# EAGLE design CAN_Shield_with_Regulator_v1.0 (EAGLE 8.1.1)
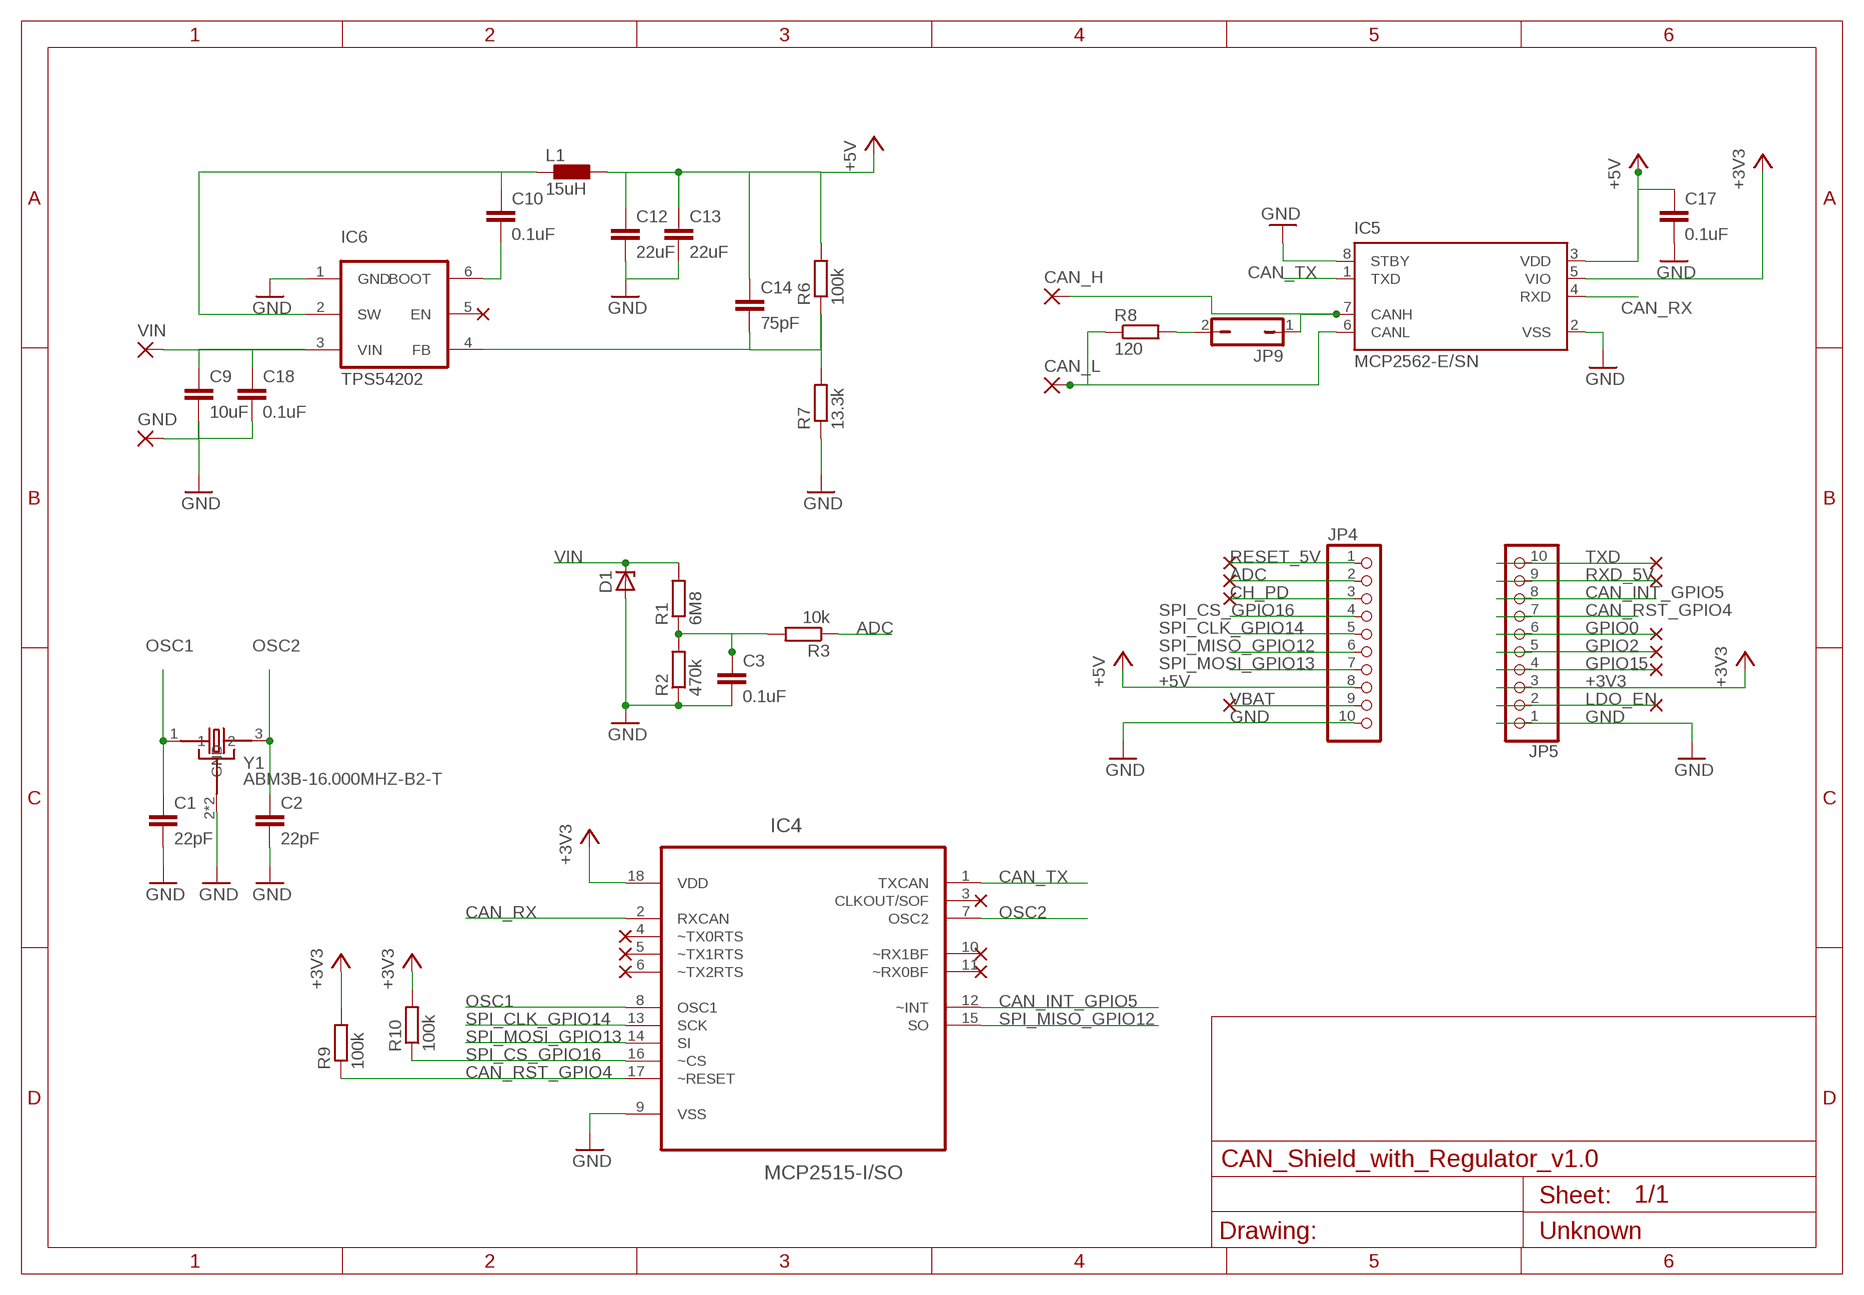
[diagram p0: schematic, sheet 1]

## Parts
C1  22pF  C  [C0805]
C2  22pF  C  [C0805]
C3  0.1uF  CC1206  [C1206]
C9  10uF  CC1206  [C1206]
C10  0.1uF  CC1206  [C1206]
C12  22uF  CC1206  [C1206]
C13  22uF  CC1206  [C1206]
C14  75pF  CC1206  [C1206]
C17  0.1uF  CC1206  [C1206]
C18  0.1uF  CC1206  [C1206]
CAN_H  WIREPADSMD5-2,5  [5-2,5]
CAN_L  WIREPADSMD5-2,5  [5-2,5]
D1  ZENER-DIODE  [SOD3715X135N]
GND  WIREPADSMD5-2,5  [5-2,5]
IC4  MCP2515-I/SO  [SOIC127P1034X264-18N]
IC5  MCP2562-E/SN  [SOIC127P600X175-8N]
IC6  TPS54202  [SOT3-6P]
JP4  HEADER-1X1070MIL  [1X10_ROUND70]
JP5  HEADER-1X1070MIL  [1X10_ROUND70]
JP9  JP1Q  [JP1]
L1  15uH  INDUCTOR  [ER1515AH]
R1  6M8  RR1206  [R1206]
R2  470k  RR1206  [R1206]
R3  10k  RR1206  [R1206]
R6  100k  RR1206  [R1206]
R7  13.3k  RR1206  [R1206]
R8  120  RR1206  [R1206]
R9  100k  RR1206  [R1206]
R10  100k  RR1206  [R1206]
VIN  WIREPADSMD5-2,5  [5-2,5]
Y1  ABM3B-16.000MHZ-B2-T  [OSCSC500X320X110-4N]

## Nets
+3V3 [power]: IC4.18(VDD) IC5.5(VIO) JP5.3 R9.2 R10.2
+5V [power]: C12.1 C13.1 C14.1 C17.1 IC5.3(VDD) JP4.8 L1.P$1 R6.2
ADC: JP4.2 R3.1
CAN_H: CAN_H.1(P) IC5.7(CANH) JP9.1
CAN_INT_GPIO5: IC4.12(~INT) JP5.8
CAN_L: CAN_L.1(P) IC5.6(CANL) R8.1
CAN_RST_GPIO4: IC4.17(~RESET) JP5.7 R9.1
CAN_RX: IC4.2(RXCAN) IC5.4(RXD)
CAN_TX: IC4.1(TXCAN) IC5.1(TXD)
CH_PD: JP4.3
GND [power]: C1.2 C2.2 C3.2 C9.2 C12.2 C13.2 C17.2 C18.2 D1.A GND.1(P) IC4.9(VSS) IC5.2(VSS) IC5.8(STBY) IC6.1(GND) JP4.10 JP5.1 R2.1 R7.1 Y1.2(GND) Y1.4(GND)
GPIO0: JP5.6
GPIO2: JP5.5
GPIO15: JP5.4
LDO_EN: JP5.2
N$1: C3.1 R1.1 R2.2 R3.2
N$3 [power]: C10.2 IC6.6(BOOT)
N$5 [power]: C10.1 IC6.2(SW) L1.P$2
N$6 [power]: C14.2 IC6.4(FB) R6.1 R7.2
N$8: JP9.2 R8.2
OSC1: C1.1 IC4.8(OSC1) Y1.1
OSC2: C2.1 IC4.7(OSC2) Y1.3
RESET_5V: JP4.1
RXD_5V: JP5.9
SPI_CLK_GPIO14: IC4.13(SCK) JP4.5
SPI_CS_GPIO16: IC4.16(~CS) JP4.4 R10.1
SPI_MISO_GPIO12: IC4.15(SO) JP4.6
SPI_MOSI_GPIO13: IC4.14(SI) JP4.7
TXD: JP5.10
VBAT: JP4.9
VIN [power]: C9.1 C18.1 D1.C IC6.3(VIN) R1.2 VIN.1(P)
Unconnected: IC4.3(CLKOUT/SOF) IC4.4(~TX0RTS) IC4.5(~TX1RTS) IC4.6(~TX2RTS) IC4.10(~RX1BF) IC4.11(~RX0BF) IC6.5(EN)

## Library data of the parts
C1-C3 C9 C10 C12-C14 C17 C18 = eagle-ltspice:C: CAPACITOR, European symbol; SPICEMODEL: NONE; SPICEPREFIX: C
CAN_H CAN_L GND VIN = wirepad:WIREPAD: Wire PAD connect wire on PCB
D1 = extras:ZENER-DIODE: Z-Diode
IC4 = MCP2515-I_SO:MCP2515-I/SO: CAN Controller; AVAILABILITY: Good; DESCRIPTION: MCP2515 Series 5.5 V 1 Mb/s Stand Alone SPI Interface CAN Controller- SOIC-18; MF: Microchip; MP: MCP2515-I/SO; PACKAGE: SOIC-18 Microchip; PRICE: 1.67 USD
IC5 = MCP2562-E_SN:MCP2562-E/SN: MCP2562 Series 5 V Surface Mount High-Speed CAN Transceiver - SOIC-8; AVAILABILITY: Good; DESCRIPTION: MCP2562 Series 5 V Surface Mount High-Speed CAN Transceiver - SOIC-8; MF: Microchip; MP: MCP2562-E/SN; PACKAGE: SOIC-8 Microchip; PRICE: 0.85 USD
IC6 = TPS54202:TPS54202; AVAILABILITY: Good; DESCRIPTION: 4.5V to 28V Input, 2A Output, EMI Friendly Synchronous Step-Down Converter 6-SOT -40 to 125; MF: Texas Instruments; MP: TPS54202DDCR; PACKAGE: TSOT-23 Texas Instruments; PRICE: 1.16 USD
JP4 JP5 = microbuilder:HEADER-1X10: PIN HEADER
JP9 = jumper:JP1Q: JUMPER
L1 = extras:INDUCTOR
R1-R3 R6-R10 = eagle-ltspice:R: RESISTOR, European symbol; SPICEMODEL: NONE; SPICEPREFIX: R
Y1 = ABM3B-16.000MHZ-B2-T:ABM3B-16.000MHZ-B2-T: Crystal 16MHz 20ppm (Tol) 50ppm (Stability) 18pF FUND 50Ohm 4-Pin CSMD T/R; AVAILABILITY: Good; DESCRIPTION: Crystal 16MHz ??20ppm (Tol) ??50ppm (Stability) 18pF FUND 50Ohm 4-Pin CSMD T/R; MF: Abracon; MP: ABM3B-16.000MHZ-B2-T; PACKAGE: 5.0 x 3.2mm Abracon; PRICE: 0.53 USD

## Net classes
0 default: width 0.254 mm, drill 0.457 mm, clearance 0.254 mm
1 power: width 0.406 mm, drill 0.457 mm, clearance 0.381 mm to class 0, clearance 0.381 mm
2 highpower: width 1.016 mm, drill 0.457 mm, clearance 0.381 mm to class 0, clearance 0.381 mm to class 1, clearance 0.381 mm

## Board
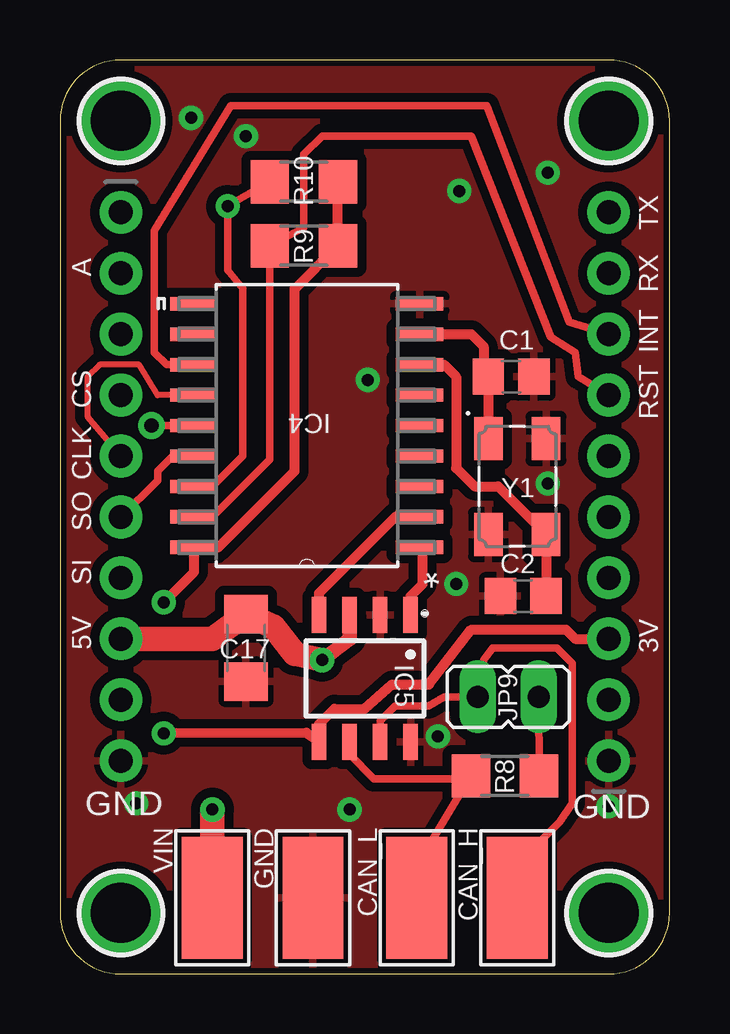
[diagram p1: board, top side]
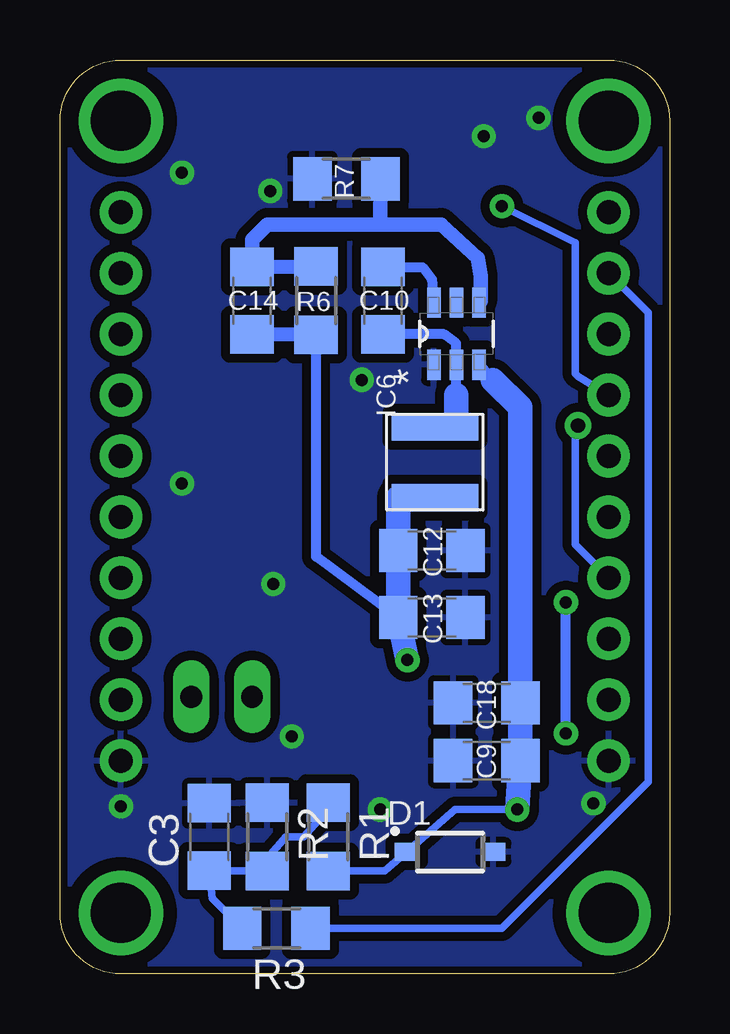
[diagram p2: board, bottom side, seen from below]

Size 25.4 x 38.1 mm. Coordinates in mm from the lower left corner, seen from the top.
Outline: 0,35.56 0,2.54 arc90 2.54,0 22.86,0 arc90 25.4,2.54 25.4,35.56 arc90 22.86,38.1 2.54,38.1 arc90 0,35.56
Copper layers (1*16): Top 0.035mm / dielectric 1.5mm / Bottom 0.035mm
Design rules "Aisler *": minimum track width 0.1mm, minimum drill 0.2mm, track to track 8mil, track to pad 8mil, pad to pad 8mil, via to via 8mil, smd to smd 8mil, copper to edge 10mil, drill to drill 8mil, minimum pad ring 12mil, minimum via ring 10mil, stop-mask expansion 4mil, vias tented up to drill 25mil, thermal gap 10mil

### Footprints (pad centres in the part's own frame; a part is rotated, then mirrored left to right if it is on the bottom)
C0805 = smd 1.3 x 1.5: 1 -0.95,0; 2 0.95,0
C1206 = smd 1.6 x 1.8: 1 -1.4,0; 2 1.4,0
5-2,5 = smd 2.54 x 5.08: 1 0,0
SOD3715X135N = smd 1 x 0.75: A 1.8,0; C -1.8,0
MOUNTINGHOLE_2.5_PLATED = drill 2.5 pad 3.2: P$1 0,0
SOIC127P1034X264-18N = smd 1.981 x 0.559: 1 -4.699,5.08; 2 -4.699,3.81; 3 -4.699,2.54; 4 -4.699,1.27; 5 -4.699,0; 6 -4.699,-1.27; 7 -4.699,-2.54; 8 -4.699,-3.81; 9 -4.699,-5.08; 10 4.699,-5.08; 11 4.699,-3.81; 12 4.699,-2.54; 13 4.699,-1.27; 14 4.699,0; 15 4.699,1.27; 16 4.699,2.54; 17 4.699,3.81; 18 4.699,5.08
SOIC127P600X175-8N = smd 1.5 x 0.6: 1 -2.65,1.905; 2 -2.65,0.635; 3 -2.65,-0.635; 4 -2.65,-1.905; 5 2.65,-1.905; 6 2.65,-0.635; 7 2.65,0.635; 8 2.65,1.905
SOT3-6P = smd 1.27 x 0.559: 1 -1.275,0.93; 2 -1.275,-0.01; 3 -1.275,-0.95; 4 1.315,-0.95; 5 1.315,-0.01; 6 1.315,0.93
1X10_ROUND70 = drill 1 pad 1.778: 1 -11.43,0; 2 -8.89,0; 3 -6.35,0; 4 -3.81,0; 5 -1.27,0; 6 1.27,0; 7 3.81,0; 8 6.35,0; 9 8.89,0; 10 11.43,0
JP1 = drill 0.914 long: 1 0,-1.27; 2 0,1.27
ER1515AH = smd 1.15 x 3.6: P$1 -1.48,0; P$2 1.48,0
R1206 = smd 1.6 x 1.803: 1 -1.422,0; 2 1.422,0
OSCSC500X320X110-4N = smd 1.2 x 1.8: 1 -1.2,2; 2 -1.2,-2; 3 1.2,-2; 4 1.2,2

### Placement (x,y rotation side)
C1  18.8,24.89 0 top
C2  19.3,15.75 180 top
C3  19.18,5.71 90 bottom
C9  7.62,8.89 180 bottom
C10  11.94,28.07 90 bottom
C12  9.91,17.65 0 bottom
C13  9.91,14.86 0 bottom
C14  17.4,28.07 90 bottom
C17  7.75,13.59 270 top
C18  7.62,11.3 180 bottom
CAN_H  19.05,3.17 0 top
CAN_L  14.86,3.17 0 top
D1  9.14,5.08 0 bottom
E$1  [MOUNTINGHOLE_2.5_PLATED]  22.86,2.54 0 top
E$2  [MOUNTINGHOLE_2.5_PLATED]  2.54,2.54 0 top
E$3  [MOUNTINGHOLE_2.5_PLATED]  2.54,35.56 0 top
E$4  [MOUNTINGHOLE_2.5_PLATED]  22.86,35.56 0 top
GND  10.54,3.17 0 top
IC4  10.29,22.86 180 top
IC5  12.7,12.32 270 top
IC6  8.89,26.67 90 bottom
JP4  2.54,20.32 270 top
JP5  22.86,20.32 90 top
JP9  18.67,11.56 270 top
L1  9.78,21.34 90 bottom
R1  14.22,5.71 270 bottom
R2  16.76,5.71 270 bottom
R3  16.38,1.91 180 bottom
R6  14.73,28.07 270 bottom
R7  13.46,33.15 0 bottom
R8  18.54,8.26 0 top
R9  10.16,30.35 0 top
R10  10.16,33.02 0 top
U$23  [HUZZAHLOGO]  21.59,30.61 0 bottom
VIN  6.35,3.17 0 top
Y1  19.05,20.32 0 top

### Tracks (layer width: path | path; a pad name or v marks a point on that pad's centre or on a via)
+3V3  (via drill 0.5)
  Top 0.406: v4.32,15.49 5.59,16.76 IC4.18 6.6,17.78 9.78,20.95 9.78,28.57 9.8,28.57 R9.2 R10.2 | JP5.3 21.46,13.97 21.08,14.35 17.14,14.35 15.37,12.06 13.84,12.06 12.7,11.05 11.43,11.05 10.79,10.41 IC5.5 10.27,10.05 v4.32,10.03
  Bottom 0.406: v4.32,10.03 v4.32,15.49
+5V  (via drill 0.5 pad 1.02)
  Top 0.406: C17.1
  Top 0.61: IC5.3 12.06,13.97 v10.92,13.08
  Top 1.016: JP4.8 6.35,13.97 C17.1 8.89,14.48 9.78,13.34 v10.92,13.08
  Bottom 0.406: R6.2 14.73,17.4 C13.1
  Bottom 0.61: R6.2 C14.1
  Bottom 1.016: v10.92,13.08 C13.1 C12.1 11.31,19.86 L1.P$1
ADC
  Bottom 0.305: R3.1 6.99,1.91 0.89,8 0.89,27.56 JP4.2
CAN_H
  Top 0.305: CAN_H.1 20.07,5.59 20.83,6.35 21.34,7.11 21.34,12.95 20.7,13.59 18.03,13.59 17.65,13.08 JP9.1 16,11.56 15.37,11.18 13.97,11.18 13.34,10.54 IC5.7
CAN_INT_GPIO5
  Top 0.305: IC4.12 4.45,25.4 3.94,25.91 3.94,30.99 7.11,36.2 17.78,36.2 21.21,27.18 JP5.8
CAN_L
  Top 0.305: CAN_L.1 15.37,5.33 R8.1 16.89,8.26 16.76,8.13 13.08,8.13 12.06,9.14 IC5.6
CAN_RST_GPIO4
  Top 0.305: IC4.17 6.35,19.05 8.74,21.44 R9.1 10.16,31.11 10.16,34.16 10.92,34.92 17.14,34.92 20.45,26.54 21.46,25.91 21.59,24.89 JP5.7
CAN_RX
  Top 0.406: IC5.4 10.79,15.88 13.97,19.05 IC4.2
CAN_TX
  Top 0.406: IC5.1 14.61,15.75 15.11,16.26 15.11,17.53 IC4.1
GND  (via drill 0.5, 0.5 pad 0.41, 0.5 pad 1.02)
  other vias: 5.46,35.69 20.32,33.4 3.17,7.11 15.75,9.91 12.83,24.77 16.51,16.26 20.32,20.45 16.64,32.64 7.75,34.92 12.06,6.86 22.86,6.99
  pour Top: 0,0 0,38.1 25.4,38.1 25.4,0
  pour Bottom (isolate 0.305): 0,0 0,38.1 25.4,38.1 25.4,0
N$1
  Bottom 0.305: 18.52,4.72 C3.1 | R1.1 14.48,6.58 14.5,6.58 15.24,5.71 16,5.71 16.76,4.83 R2.2 19.03,4.29 C3.1 | C3.1 19.05,3.15 R3.2
N$3
  Bottom 0.406: C10.2 10.29,29.46 9.91,28.96 IC6.6
N$5
  Bottom 0.406: 8.89,24.13 IC6.2 8.89,26.29 9.4,26.67 C10.1
  Bottom 1.016: L1.P$2 8.89,22.82 8.89,24.13
N$6
  Bottom 0.406: 7.87,28.05 IC6.4
  Bottom 0.61: R6.1 C14.2 17.4,30.61 16.76,31.24 12.06,31.24 | 12.06,31.24 9.53,31.24 8,29.84 7.87,29.08 7.87,28.05 | R7.2 12.06,31.24
N$8
  Top 0.305: JP9.2 R8.2
OSC1
  Top 0.406: IC4.8 17.14,26.67 17.65,26.16 17.65,25.09 C1.1 Y1.1
OSC2
  Top 0.406: IC4.7 16,25.4 16.51,24.89 16.51,21.08 17.27,20.32 18.25,20.32 Y1.3 | Y1.3 20.25,17.85 20.32,17.78 | Y1.3 C2.1
SPI_CLK_GPIO14
  Top 0.254: IC4.13 4.06,24.13 3.3,25.4 1.65,25.4 1.14,24.89 1.14,23.24 JP4.5
SPI_CS_GPIO16  (via drill 0.5)
  Top 0.305: IC4.16 6.35,20.32 7.62,21.59 7.62,28.57 6.99,29.34 6.99,31.75 | 6.99,31.75 v6.99,32 | R10.1 6.96,32 6.99,31.75
  Bottom 0.305: v6.99,32 3.94,30.48 3.94,25.02 3.81,24.89 JP4.4
SPI_MISO_GPIO12
  Top 0.305: IC4.15 4.7,21.59 4.06,20.95 4.06,20.57 JP4.6
SPI_MOSI_GPIO13  (via drill 0.6)
  Top 0.305: 4.7,22.86 IC4.14 v3.81,22.86
  Bottom 0.305: JP4.7 3.94,17.91 3.94,22.73 v3.81,22.86
VIN  (via drill 0.5 pad 1.02)
  Top 1.016: VIN.1 v6.35,6.86
  Bottom 0.305: R1.2 11.88,4.29 D1.C 8.93,6.86 v6.35,6.86
  Bottom 0.406: 7.37,24.77 IC6.3
  Bottom 1.016: 7.37,24.77 6.22,23.62 C18.1 C9.1 v6.35,6.86

### Text on the board
tPlace: TX | A | RX | INT | CS | RST | CLK | SO | SI | 5V | 3V | GND | GND